# EAGLE design freeDSP (EAGLE 7.6.0)
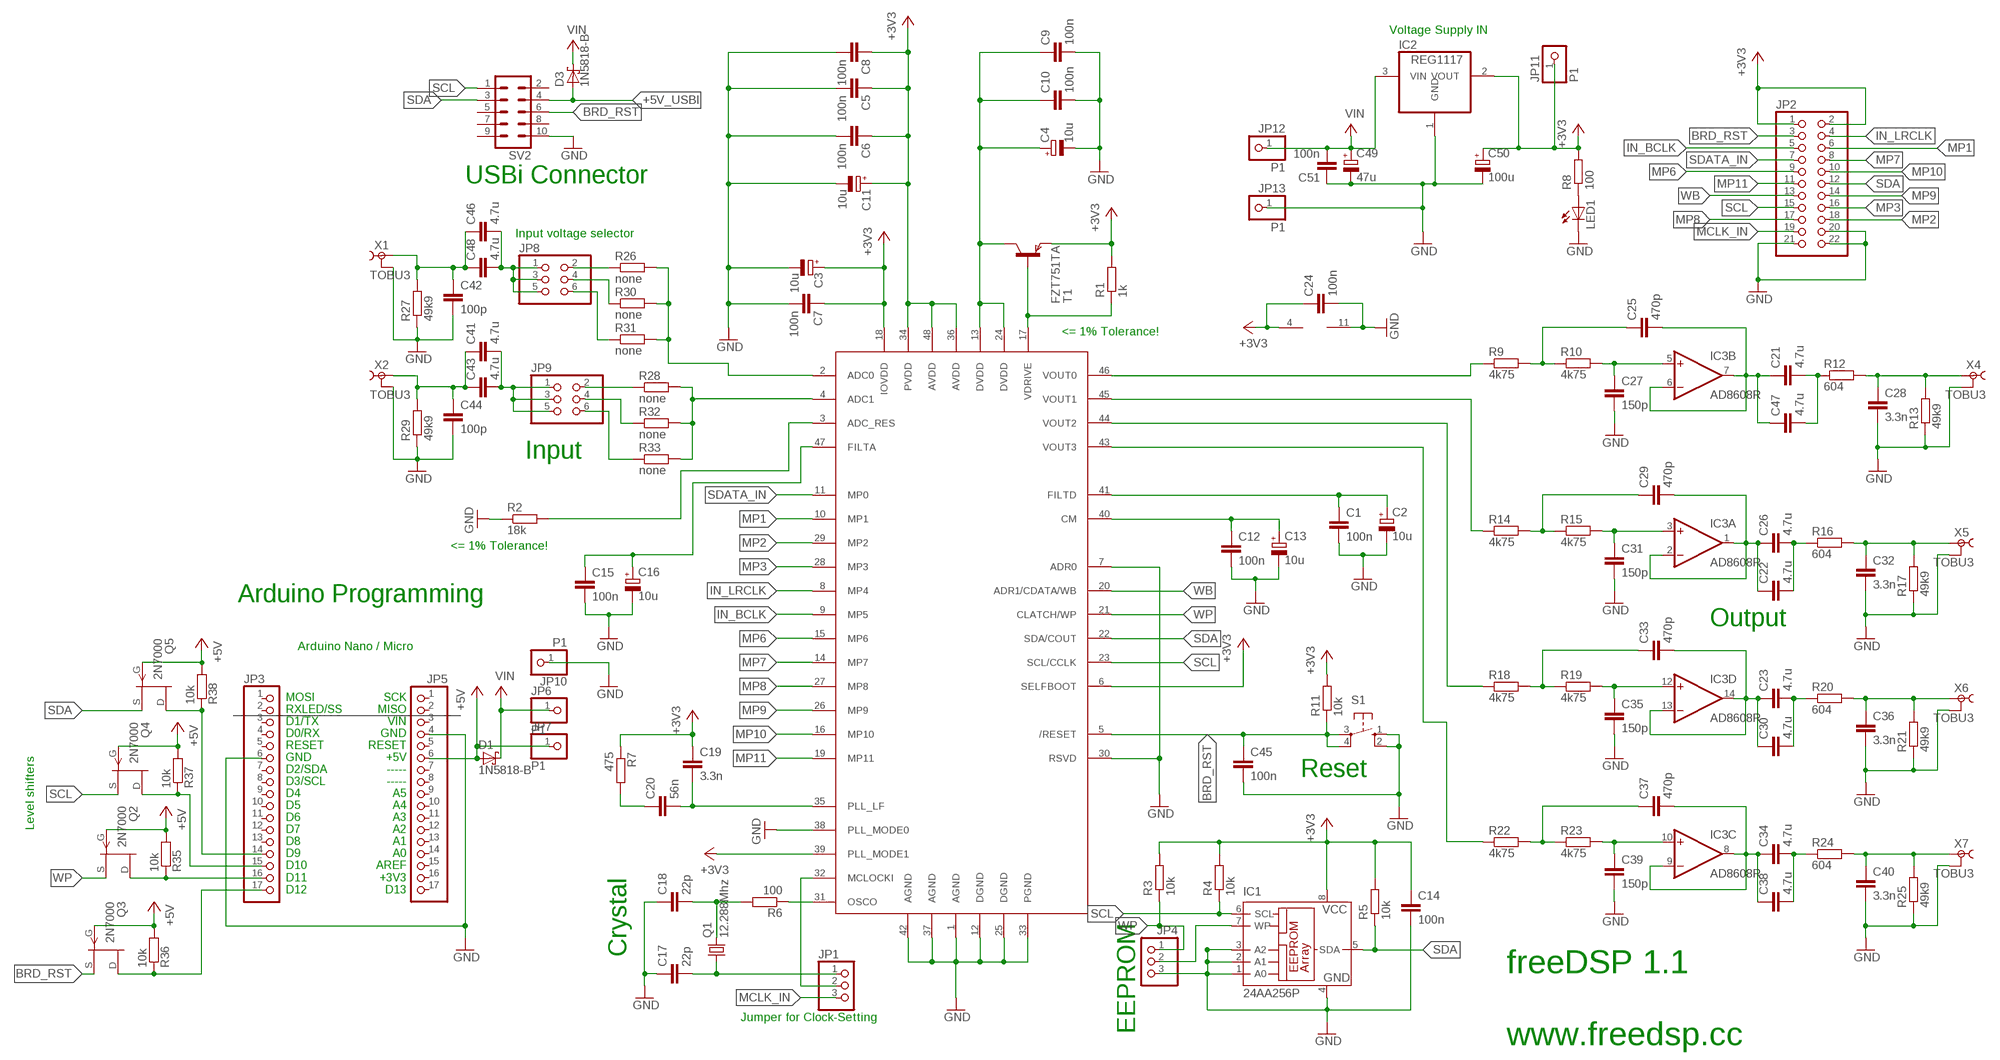
[diagram p0: schematic, sheet 1]

## Parts
C1  100n  C-EU050-025X075  [C050-025X075]
C2  10u  CPOL-EUE1.8-4  [E1,8-4]
C3  10u  CPOL-EUE1.8-4  [E1,8-4]
C4  10u  CPOL-EUE1.8-4  [E1,8-4]
C5  100n  C-EU050-025X075  [C050-025X075]
C6  100n  C-EU050-025X075  [C050-025X075]
C7  100n  C-EU050-025X075  [C050-025X075]
C8  100n  C-EU050-025X075  [C050-025X075]
C9  100n  C-EU050-025X075  [C050-025X075]
C10  100n  C-EU050-025X075  [C050-025X075]
C11  10u  CPOL-EUE1.8-4  [E1,8-4]
C12  100n  C-EU050-025X075  [C050-025X075]
C13  10u  CPOL-EUE1.8-4  [E1,8-4]
C14  100n  C-EU050-025X075  [C050-025X075]
C15  100n  C-EU050-025X075  [C050-025X075]
C16  10u  CPOL-EUE1.8-4  [E1,8-4]
C17  22p  C-EU025-025X050  [C025-025X050]
C18  22p  C-EU025-025X050  [C025-025X050]
C19  3.3n  C-EU050-025X075  [C050-025X075]
C20  56n  C-EU050-025X075  [C050-025X075]
C21  4.7u  C-EU025-025X050  [C025-025X050]
C22  4.7u  C-EU025-025X050  [C025-025X050]
C23  4.7u  C-EU025-025X050  [C025-025X050]
C24  100n  C-EU050-025X075  [C050-025X075]
C25  470p  C-EU050-050X075  [C050-050X075]
C26  4.7u  C-EU025-025X050  [C025-025X050]
C27  150p  C-EU050-050X075  [C050-050X075]
C28  3.3n  C-EU050-025X075  [C050-025X075]
C29  470p  C-EU050-050X075  [C050-050X075]
C30  4.7u  C-EU025-025X050  [C025-025X050]
C31  150p  C-EU050-050X075  [C050-050X075]
C32  3.3n  C-EU050-025X075  [C050-025X075]
C33  470p  C-EU050-050X075  [C050-050X075]
C34  4.7u  C-EU025-025X050  [C025-025X050]
C35  150p  C-EU050-050X075  [C050-050X075]
C36  3.3n  C-EU050-025X075  [C050-025X075]
C37  470p  C-EU050-050X075  [C050-050X075]
C38  4.7u  C-EU025-025X050  [C025-025X050]
C39  150p  C-EU050-050X075  [C050-050X075]
C40  3.3n  C-EU050-025X075  [C050-025X075]
C41  4.7u  C-EU025-025X050  [C025-025X050]
C42  100p  C-EU025-025X050  [C025-025X050]
C43  4.7u  C-EU025-025X050  [C025-025X050]
C44  100p  C-EU025-025X050  [C025-025X050]
C45  100n  C-EU050-025X075  [C050-025X075]
C46  4.7u  C-EU025-025X050  [C025-025X050]
C47  4.7u  C-EU025-025X050  [C025-025X050]
C48  4.7u  C-EU025-025X050  [C025-025X050]
C49  47u  CPOL-EUE2.5-6  [E2,5-6]
C50  100u  CPOL-EUE2.5-6  [E2,5-6]
C51  100n  C-EU050-025X075  [C050-025X075]
D1  1N5818-B  [DO41-7.6]
D3  1N5818-B  [DO41-7.6]
IC1  24AA256P  [DIL8]
IC2  REG1117  [SOT223]
IC3  AD8608R  [SO-14]
JP1  PINHD-1X3  [1X03]
JP2  PINHD-2X11  [2X11]
JP3  PINHD-1X17  [1X17]
JP4  PINHD-1X3  [1X03]
JP5  PINHD-1X17  [1X17]
JP6  P1  PINHD-1X1  [1X01]
JP7  P1  PINHD-1X1  [1X01]
JP8  PINHD-2X3  [2X03]
JP9  PINHD-2X3  [2X03]
JP10  P1  PINHD-1X1  [1X01]
JP11  P1  PINHD-1X1  [1X01]
JP12  P1  PINHD-1X1  [1X01]
JP13  P1  PINHD-1X1  [1X01]
LED1  LED3MM  [LED3MM]
Q1  12.288Mhz  CRYSTALSM49  [SM49]
Q2  2N7000  2N3819  [TO92]
Q3  2N7000  2N3819  [TO92]
Q4  2N7000  2N3819  [TO92]
Q5  2N7000  2N3819  [TO92]
R1  1k  R-EU_0204/7  [0204/7]
R2  18k  R-EU_0204/7  [0204/7]
R3  10k  R-EU_0204/7  [0204/7]
R4  10k  R-EU_0204/7  [0204/7]
R5  10k  R-EU_0204/7  [0204/7]
R6  100  R-EU_0204/7  [0204/7]
R7  475  R-EU_0204/7  [0204/7]
R8  100  R-EU_0204/7  [0204/7]
R9  4k75  R-EU_0204/7  [0204/7]
R10  4k75  R-EU_0204/7  [0204/7]
R11  10k  R-EU_0204/7  [0204/7]
R12  604  R-EU_0204/7  [0204/7]
R13  49k9  R-EU_0204/7  [0204/7]
R14  4k75  R-EU_0204/7  [0204/7]
R15  4k75  R-EU_0204/7  [0204/7]
R16  604  R-EU_0204/7  [0204/7]
R17  49k9  R-EU_0204/7  [0204/7]
R18  4k75  R-EU_0204/7  [0204/7]
R19  4k75  R-EU_0204/7  [0204/7]
R20  604  R-EU_0204/7  [0204/7]
R21  49k9  R-EU_0204/7  [0204/7]
R22  4k75  R-EU_0204/7  [0204/7]
R23  4k75  R-EU_0204/7  [0204/7]
R24  604  R-EU_0204/7  [0204/7]
R25  49k9  R-EU_0204/7  [0204/7]
R26  none  R-EU_0204/7  [0204/7]
R27  49k9  R-EU_0204/7  [0204/7]
R28  none  R-EU_0204/7  [0204/7]
R29  49k9  R-EU_0204/7  [0204/7]
R30  none  R-EU_0204/7  [0204/7]
R31  none  R-EU_0204/7  [0204/7]
R32  none  R-EU_0204/7  [0204/7]
R33  none  R-EU_0204/7  [0204/7]
R35  10k  R-EU_0204/7  [0204/7]
R36  10k  R-EU_0204/7  [0204/7]
R37  10k  R-EU_0204/7  [0204/7]
R38  10k  R-EU_0204/7  [0204/7]
S1  10-XX  [B3F-10XX]
SV2  ML10  [ML10]
T1  FZT751TA  FZT789A  [SOT223]
U$1  ADAU1701  [LQFP-48]
X1  TOBU3  [TOBU3]
X2  TOBU3  [TOBU3]
X4  TOBU3  [TOBU3]
X5  TOBU3  [TOBU3]
X6  TOBU3  [TOBU3]
X7  TOBU3  [TOBU3]

## Nets
1V8: C4.+ C9.1 C10.1 T1.2(C) T1.4(C) U$1.13(DVDD) U$1.24(DVDD)
+3V3: C3.+ C5.1 C6.1 C7.1 C8.1 C11.+ C14.1 C19.1 C24.1 C50.+ IC1.8(VCC) IC2.2(VOUT) IC3.4(V+) JP2.1 JP2.2 JP11.1 R1.2 R3.2 R4.2 R5.2 R7.1 R8.2 R11.2 T1.3(E) U$1.6(SELFBOOT) U$1.18(IOVDD) U$1.34(PVDD) U$1.36(AVDD) U$1.39(PLL_MODE1) U$1.48(AVDD)
+5V: D1.A JP5.6 JP7.1 Q2.2(G) Q3.2(G) Q4.2(G) Q5.2(G) R35.2 R36.2 R37.2 R38.2
+5V_USBI: D3.A SV2.4
ADC0: R28.2 R32.2 R33.2 U$1.4(ADC1)
BRD_RST: C45.1 JP2.3 Q3.3(S) R11.1 S1.3(P) S1.4(P1) SV2.6 U$1.5(/RESET)
CM: C12.1 C13.+ U$1.40(CM)
FILTA: C15.1 C16.+ U$1.47(FILTA)
FILTD: C1.1 C2.+ U$1.41(FILTD)
FILTOUT0: C28.1 R12.2 R13.2 X4.1
FILTOUT1: C32.1 R16.2 R17.2 X5.1
FILTOUT2: C36.1 R20.2 R21.2 X6.1
FILTOUT3: C40.1 R24.2 R25.2 X7.1
GND: C1.2 C2.- C3.- C4.- C5.2 C6.2 C7.2 C8.2 C9.2 C10.2 C11.- C12.2 C13.- C14.2 C15.2 C16.- C17.1 C18.1 C24.2 C27.2 C28.2 C31.2 C32.2 C35.2 C36.2 C39.2 C40.2 C42.2 C44.2 C45.2 C49.- C50.- C51.1 IC1.1(A0) IC1.2(A1) IC1.3(A2) IC1.4(GND) IC2.1(GND) IC3.11(V-) JP2.20 JP2.21 JP2.22 JP3.6 JP4.3 JP5.4 JP10.1 JP13.1 LED1.K(C) R2.1 R13.1 R17.1 R21.1 R25.1 R27.1 R29.1 S1.1(S) S1.2(S1) SV2.10 U$1.1(AGND) U$1.7(ADR0) U$1.12(DGND) U$1.25(DGND) U$1.30(RSVD) U$1.33(PGND) U$1.37(AGND) U$1.38(PLL_MODE0) U$1.42(AGND) X1.2 X1.2@1 X1.2@2 X2.2 X2.2@1 X2.2@2 X4.2 X4.2@1 X4.2@2 X5.2 X5.2@1 X5.2@2 X6.2 X6.2@1 X6.2@2 X7.2 X7.2@1 X7.2@2
IN_BCLK: JP2.5 U$1.9(MP5)
IN_LRCLK: JP2.4 U$1.8(MP4)
MCLK_IN: JP1.3 JP2.19
MP1: JP2.6 U$1.10(MP1)
MP2: JP2.18 U$1.29(MP2)
MP3: JP2.16 U$1.28(MP3)
MP6: JP2.9 U$1.15(MP6)
MP7: JP2.8 U$1.14(MP7)
MP8: JP2.17 U$1.27(MP8)
MP9: JP2.14 U$1.26(MP9)
MP10: JP2.10 U$1.16(MP10)
MP11: JP2.11 U$1.19(MP11)
N$1: R2.2 U$1.3(ADC_RES)
N$2: R1.1 T1.1(B) U$1.17(VDRIVE)
N$3: C19.2 C20.2 U$1.35(PLL_LF)
N$4: C23.1 C30.1 C33.2 IC3.13(D:-IN) IC3.14(D:OUT)
N$5: C20.1 R7.2
N$6: C18.2 Q1.2 R6.2
N$7: C17.2 JP1.1 Q1.1
N$8: R6.1 U$1.31(OSCO)
N$9: LED1.A R8.1
N$10: JP1.2 U$1.32(MCLOCKI)
N$11: JP3.15 Q4.1(D) R37.1
N$12: C21.2 C47.2 R12.1
N$13: C29.1 R14.2 R15.1
N$14: JP3.14 Q5.1(D) R38.1
N$15: C22.1 C26.1 C29.2 IC3.1(A:OUT) IC3.2(A:-IN)
N$16: C31.1 IC3.3(A:+IN) R15.2
N$17: C25.1 R9.2 R10.1
N$18: C21.1 C25.2 C47.1 IC3.6(B:-IN) IC3.7(B:OUT)
N$19: C22.2 C26.2 R16.1
N$20: C27.1 IC3.5(B:+IN) R10.2
N$21: C33.1 R18.2 R19.1
N$22: C23.2 C30.2 R20.1
N$23: JP3.16 Q2.1(D) R35.1
N$24: C35.1 IC3.12(D:+IN) R19.2
N$25: JP3.17 Q3.1(D) R36.1
N$26: C37.1 R22.2 R23.1
N$27: C34.1 C37.2 C38.1 IC3.8(C:OUT) IC3.9(C:-IN)
N$28: C39.1 IC3.10(C:+IN) R23.2
N$29: C34.2 C38.2 R24.1
N$30: C46.2 C48.2 JP8.1 JP8.3 JP8.5
N$31: C42.1 C46.1 C48.1 R27.2 X1.1
N$32: JP8.2 R26.1
N$33: JP8.4 R30.1
N$34: C41.1 C43.1 C44.1 R29.2 X2.1
N$35: JP8.6 R31.1
N$36: C41.2 C43.2 JP9.1 JP9.3 JP9.5
N$37: JP9.2 R28.1
N$38: JP9.4 R32.1
N$39: JP9.6 R33.1
N$40: R26.2 R30.2 R31.2 U$1.2(ADC0)
N$43: IC1.7(WP) JP4.2
SCL: IC1.6(SCL) JP2.15 Q4.3(S) R4.1 SV2.1 U$1.23(SCL/CCLK)
SDA: IC1.5(SDA) JP2.12 Q5.3(S) R5.1 SV2.3 U$1.22(SDA/COUT)
SDATA_IN: JP2.7 U$1.11(MP0)
V+: C49.+ C51.2 D1.C D3.C IC2.3(VIN) JP6.1 JP12.1 ; supply symbol labelled VIN
VOUT0: R9.1 U$1.46(VOUT0)
VOUT1: R14.1 U$1.45(VOUT1)
VOUT2: R18.1 U$1.44(VOUT2)
VOUT3: R22.1 U$1.43(VOUT3)
WB: JP2.13 U$1.20(ADR1/CDATA/WB)
WP: JP4.1 Q2.3(S) R3.1 U$1.21(CLATCH/WP)
Unconnected: JP3.1 JP3.2 JP3.3 JP3.4 JP3.5 JP3.7 JP3.8 JP3.9 JP3.10 JP3.11 JP3.12 JP3.13 JP5.1 JP5.2 JP5.3 JP5.5 JP5.7 JP5.8 JP5.9 JP5.10 JP5.11 JP5.12 JP5.13 JP5.14 JP5.15 JP5.16 JP5.17 SV2.2 SV2.5 SV2.7 SV2.8 SV2.9

## Notes on the sheet
- Voltage Supply IN
- USBi Connector
- Input voltage selector
- <= 1% Tolerance!
- Input
- <= 1% Tolerance!
- Arduino Programming
- Output
- Arduino Nano / Micro
- Reset
- Level shifters
- Crystal
- MOSI
  RXLED/SS
  D1/TX
  D0/RX
  RESET
  GND
  D2/SDA
  D3/SCL
  D4
  D5
  D6
  D7
  D8
  D9
  D10
  D11
  D12
- SCK
  MISO
  VIN
  GND
  RESET
  +5V
  -----
  -----
  A5
  A4
  A3
  A2
  A1
  A0
  AREF
  +3V3
  D13
- Jumper for Clock-Setting
- EEPROM
- freeDSP 1.1
  
  www.freedsp.cc

## Library data of the parts
C1 C5-C10 C12 C14 C15 C19-C24 C26-C28 C30-C32 C34-C36 C38-C41 C43 C45-C48 C51 = resistor:C-EU: CAPACITOR, European symbol
C2-C4 C11 C13 C16 C49 C50 = rcl:CPOL-EU: POLARIZED CAPACITOR, European symbol
C17 C18 C25 C29 C33 C37 C42 C44 = rcl:C-EU: CAPACITOR, European symbol
D1 D3 = diode:1N581*: 1.0A SCHOTTKY BARRIER RECTIFIER Source: http://www.diodes.com/datasheets/ds23001.pdf
IC1 = microchip:24*: Serial EEPROM I2C; MF: MICROCHIP; MPN: 24AA256-I/P; OC_FARNELL: 1331294; OC_NEWARK: 92C6872
IC2 = burr-brown:REG1117: 800mA and 1A Low Dropout (LDO) Positive Regulator 1.8V, 2.5V, 2.85V, 3.3V, 5V, and Adj; MPN: REG1117; OC_FARNELL: 1097566; OC_NEWARK: 14P6981
IC3 = 0-ADI-variety:AD8608*
JP1 JP4 = pinhead:PINHD-1X3: PIN HEADER
JP2 = pinhead:PINHD-2X11: PIN HEADER
JP3 JP5 = pinhead:PINHD-1X17: PIN HEADER
JP6 JP7 JP10-JP13 = adafruit:PINHD-1X1: Pin header 1x1 for 0.1" spacing With round pins
JP8 JP9 = pinhead:PINHD-2X3: PIN HEADER
LED1 = led:LED: LED OSRAM: - CHIPLED LG R971, LG N971, LY N971, LG Q971, LY Q971, LO R971, LY R971 LH N974, LH R974 LS Q976, LO Q976, LY Q976 LO Q996 - Hyper CHIPLED LW Q18S LB Q993, LB Q99A, LB R99A - SideLED LS A670, LO A670, LY A670, LG A670, LP A670 LB A673, LV A673, LT A673, LW A673 LH A674 LY A675 LS A676, LA A676, LO A676, LY A676, LW A676 LS A679, LY A679, LG A679 - Hyper Micro SIDELED® LS Y876, LA Y876, LO Y876, LY Y876 LT Y87S - SmartLED LW L88C, LW L88S LB L89C, LB L89S, LG L890 LS L89K, LO L89K, LY L89K LS L896, LA L896, LO L896, LY L896 - TOPLED LS T670, LO T670, LY T670, LG T670, LP T670 LSG T670, LSP T670, LSY T670, LOP T670, LYG T670 LG T671, LOG T671, LSG T671 LB T673, LV T673, LT T673, LW T673 LH T674 LS T676, LA T676, LO T676, LY T676, LB T676, LH T676, LSB T676, LW T676 LB T67C, LV T67C, LT T67C, LS T67K, LO T67K, LY T67K, LW E67C LS E67B, LA E67B, LO E67B, LY E67B, LB E67C, LV E67C, LT E67C LW T67C LS T679, LY T679, LG T679 LS T770, LO T770, LY T770, LG T770, LP T770 LB T773, LV T773, LT T773, LW T773 LH T774 LS E675, LA E675, LY E675, LS T675 LS T776, LA T776, LO T776, LY T776, LB T776 LHGB T686 LT T68C, LB T68C - Hyper Mini TOPLED® LB M676 - Mini TOPLED Santana® LG M470 LS M47K, LO M47K, LY M47K Source: http://www.osram.convergy.de LUXEON: - LUMILED® LXK2-PW12-R00, LXK2-PW12-S00, LXK2-PW14-U00, LXK2-PW14-V00 LXK2-PM12-R00, LXK2-PM12-S00, LXK2-PM14-U00 LXK2-PE12-Q00, LXK2-PE12-R00, LXK2-PE12-S00, LXK2-PE14-T00, LXK2-PE14-U00 LXK2-PB12-K00, LXK2-PB12-L00, LXK2-PB12-M00, LXK2-PB14-N00, LXK2-PB14-P00, LXK2-PB14-Q00 LXK2-PR12-L00, LXK2-PR12-M00, LXK2-PR14-Q00, LXK2-PR14-R00 LXK2-PD12-Q00, LXK2-PD12-R00, LXK2-PD12-S00 LXK2-PH12-R00, LXK2-PH12-S00 LXK2-PL12-P00, LXK2-PL12-Q00, LXK2-PL12-R00 Source: www.luxeon.com KINGBRIGHT: KA-3528ASYC Source: www.kingbright.com
Q1 = crystal:CRYSTAL: CRYSTAL; OC_FARNELL: unknown; OC_NEWARK: unknown
Q2-Q5 = transistor-fet:2N3819: N-Channel Junction FET
R1-R33 R35-R38 = resistor:R-EU_: RESISTOR, European symbol
S1 = switch-omron:10-XX: OMRON SWITCH; MPN: B3F-1000; OC_FARNELL: 176432; OC_NEWARK: 36M3542
SV2 = con-harting-ml:ML10: HARTING; OC_FARNELL: unknown; OC_NEWARK: unknown
T1 = zetex:FZT789A: PNP TRANSISTOR; MPN: FZT789A; OC_FARNELL: 9526633; OC_NEWARK: 97K0407
U$1 = analog-devices_2:ADAU1701
X1 X2 X4-X7 = con-hirschmann_verbessert:TOBU3: Female Cinch CONNECTOR ( RCA Jack ); MF: FARNELL; MPN: TOBU 3; OC_FARNELL: 592791; OC_NEWARK: 06WX5914

## Net classes
0 default: width 0.152 mm

## Board
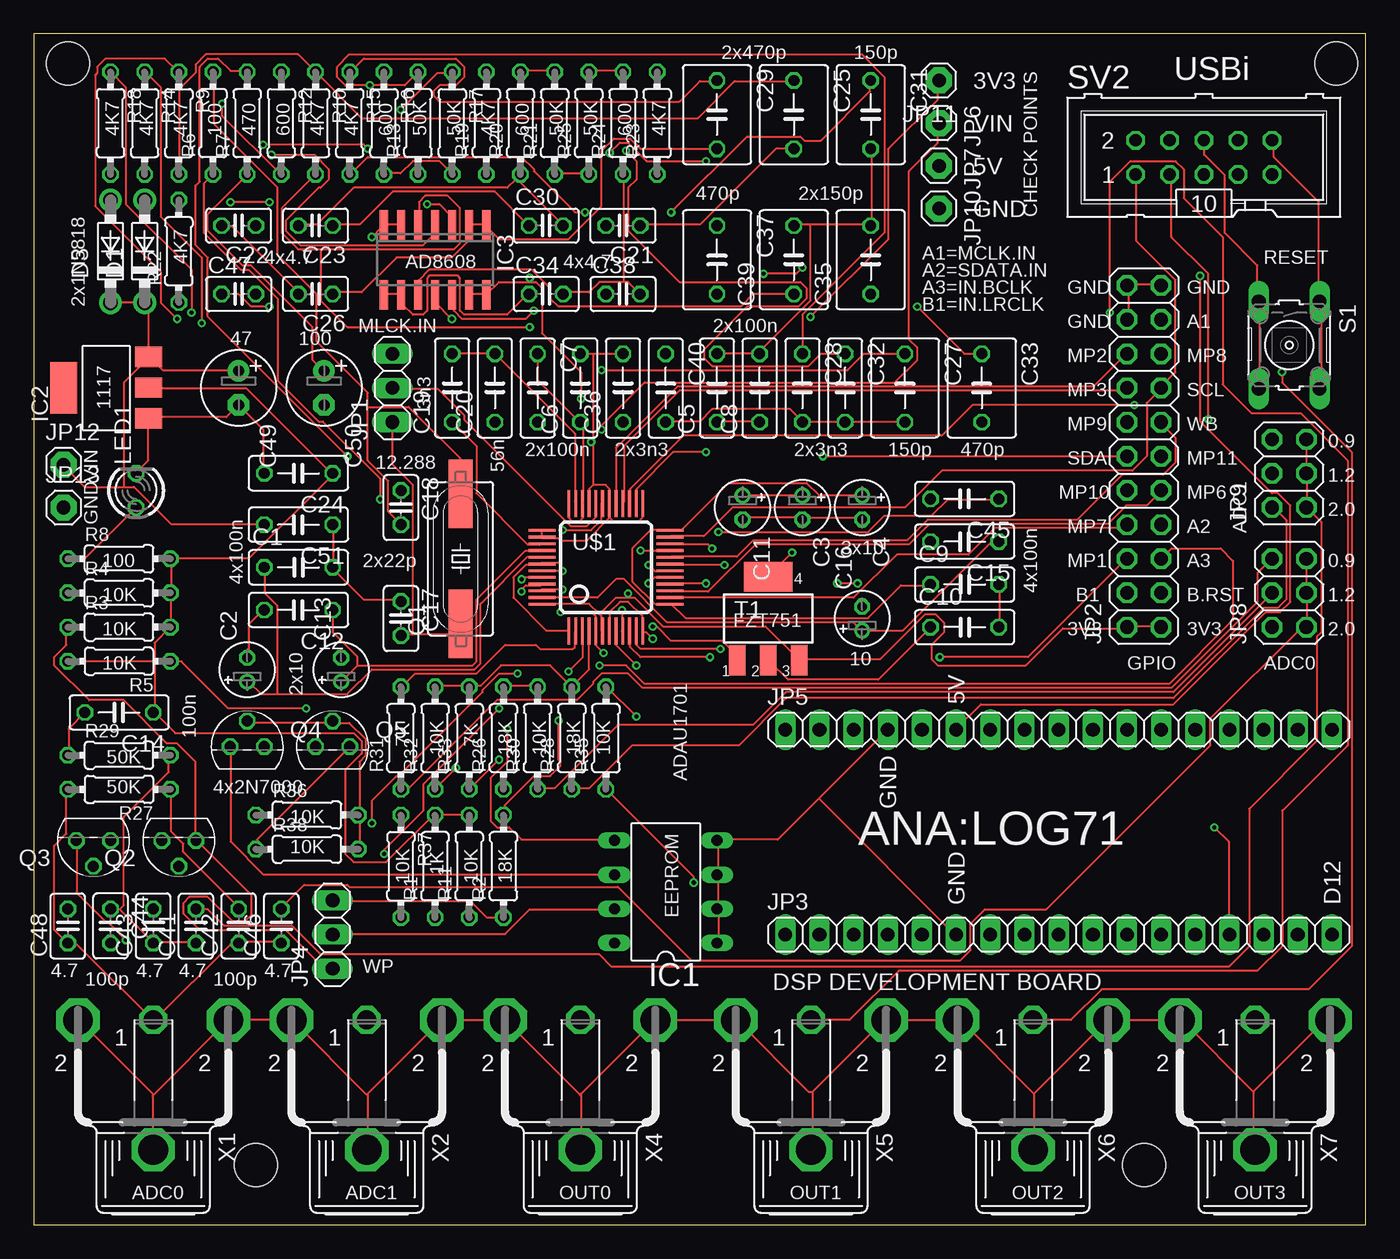
[diagram p1: board, top side]
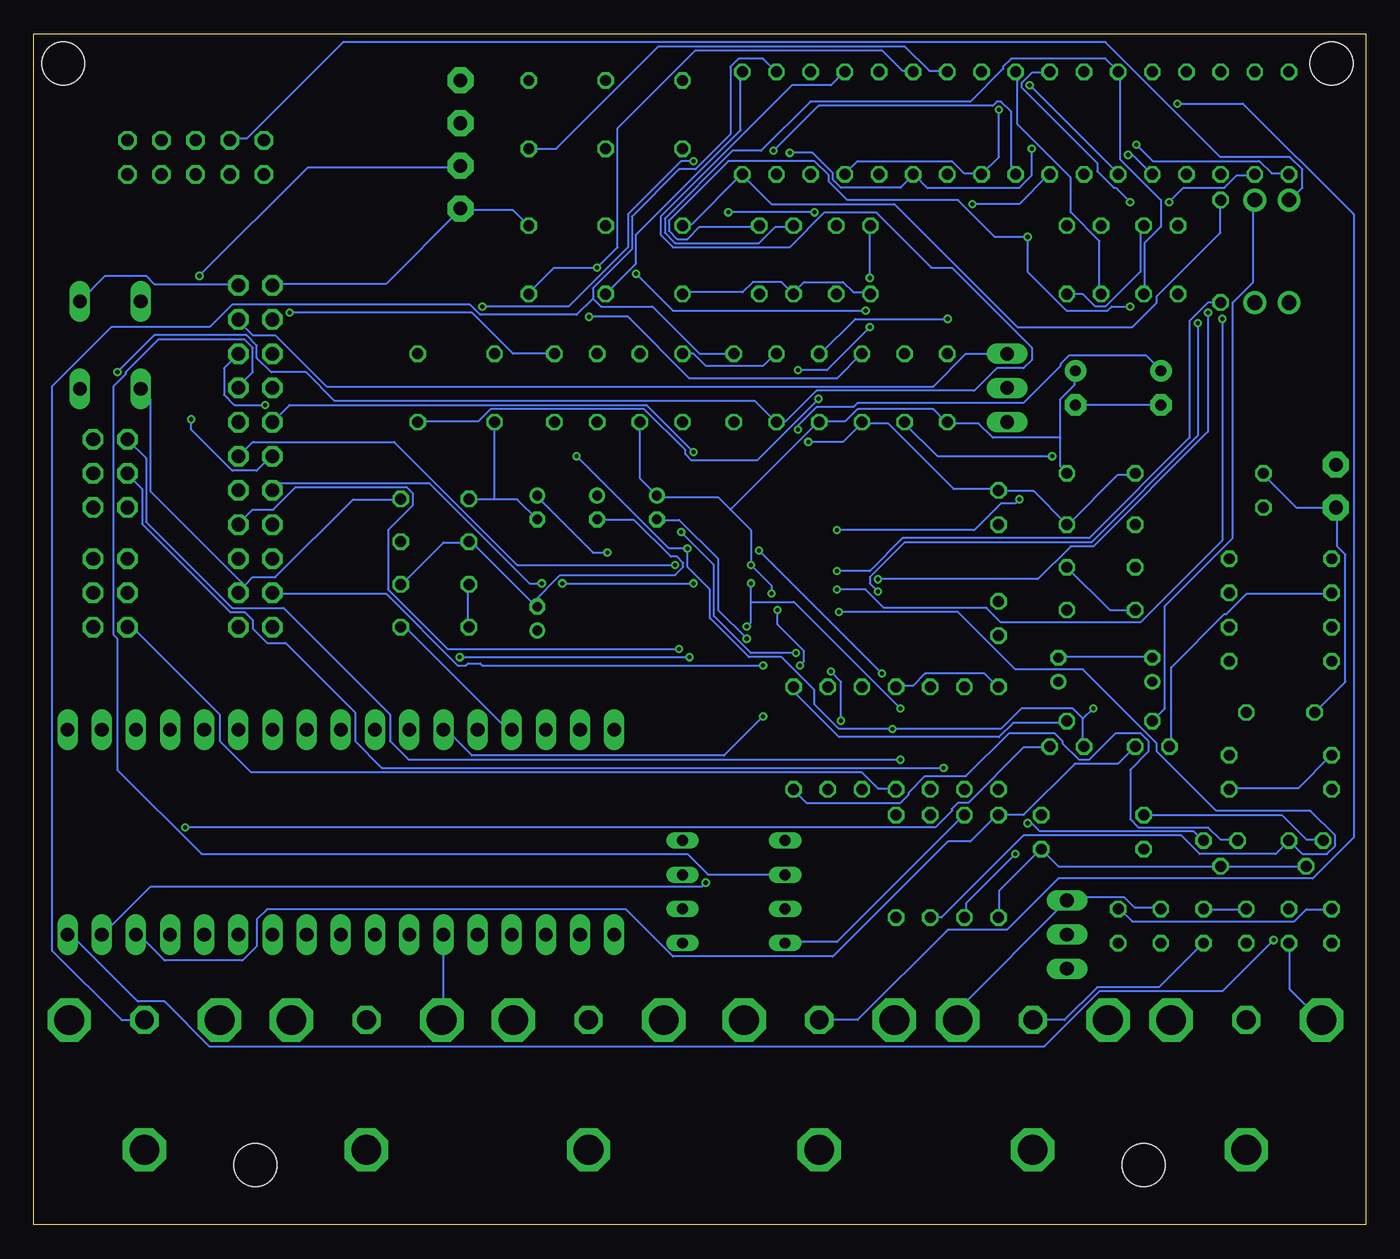
[diagram p2: board, bottom side, seen from below]

Size 99.04 x 88.57 mm. Coordinates in mm from the lower left corner, seen from the top.
Outline: 0,0 99.04,0 99.04,88.57 0,88.57 0,0
Copper layers (1*16): Top 0.035mm / dielectric 1.6mm / Bottom 0.035mm
Design rules "Elecrow_2-layer_PCB_eagle_rule": minimum track width 6mil, minimum drill 12mil, track to track 6mil, track to pad 8mil, pad to pad 12mil, via to via 12mil, smd to smd 0mil, copper to edge 20mil, drill to drill 10mil, minimum pad ring 6mil, minimum via ring 6mil, stop-mask expansion 0mil, vias tented up to drill 100mil, thermal gap 10mil
Holes 3.2 mm at 2.54,86.36 96.84,86.36 16.51,4.45 82.55,4.45

### Footprints (pad centres in the part's own frame; a part is rotated, then mirrored left to right if it is on the bottom)
C050-025X075 = drill 0.813 octagon: 1 -2.54,0; 2 2.54,0
E1,8-4 = drill 0.711 pad 1.168: + -0.889,0 | drill 0.711 pad 1.168 octagon: - 0.889,0
C025-025X050 = drill 0.813 octagon: 1 -1.27,0; 2 1.27,0
C050-050X075 = drill 0.813 octagon: 1 -2.54,0; 2 2.54,0
E2,5-6 = drill 0.813 pad 1.6: + -1.27,0 | drill 0.813 pad 1.6 octagon: - 1.27,0
DO41-7.6 = drill 1.1 pad 1.7: A 3.81,0; C -3.81,0
DIL8 = drill 0.813 long: 1 -3.81,-3.81; 2 -1.27,-3.81; 3 1.27,-3.81; 4 3.81,-3.81; 5 3.81,3.81; 6 1.27,3.81; 7 -1.27,3.81; 8 -3.81,3.81
SOT223 = smd 1.499 x 2.007: 1 -2.261,-3.15; 2 0.025,-3.15; 3 2.311,-3.15 | smd 3.81 x 2.007: 4 0,3.15
SO-14 = smd 0.6 x 2.2: 1 -3.81,-2.6; 2 -2.54,-2.6; 3 -1.27,-2.6; 4 0,-2.6; 5 1.27,-2.6; 6 2.54,-2.6; 7 3.81,-2.6; 8 3.81,2.6; 9 2.54,2.6; 10 1.27,2.6; 11 0,2.6; 12 -1.27,2.6; 13 -2.54,2.6; 14 -3.81,2.6
1X03 = drill 1.016 long: 1 -2.54,0; 2 0,0; 3 2.54,0
2X11 = drill 1.016 octagon: 1 -12.7,-1.27; 2 -12.7,1.27; 3 -10.16,-1.27; 4 -10.16,1.27; 5 -7.62,-1.27; 6 -7.62,1.27; 7 -5.08,-1.27; 8 -5.08,1.27; 9 -2.54,-1.27; 10 -2.54,1.27; 11 0,-1.27; 12 0,1.27; 13 2.54,-1.27; 14 2.54,1.27; 15 5.08,-1.27; 16 5.08,1.27; 17 7.62,-1.27; 18 7.62,1.27; 19 10.16,-1.27; 20 10.16,1.27; 21 12.7,-1.27; 22 12.7,1.27
1X17 = drill 1.016 long: 1 -20.32,0; 2 -17.78,0; 3 -15.24,0; 4 -12.7,0; 5 -10.16,0; 6 -7.62,0; 7 -5.08,0; 8 -2.54,0; 9 0,0; 10 2.54,0; 11 5.08,0; 12 7.62,0; 13 10.16,0; 14 12.7,0; 15 15.24,0; 16 17.78,0; 17 20.32,0
1X01 = drill 1.016 pad 1.93 octagon: 1 0,0
2X03 = drill 1.016 octagon: 1 -2.54,-1.27; 2 -2.54,1.27; 3 0,-1.27; 4 0,1.27; 5 2.54,-1.27; 6 2.54,1.27
LED3MM = drill 0.813 octagon: A -1.27,0; K 1.27,0
SM49 = smd 5.08 x 1.778: 1 -4.826,0; 2 4.826,0
TO92 = drill 0.813 octagon: 1 1.27,0; 2 0,1.905; 3 -1.27,0
0204/7 = drill 0.813 octagon: 1 -3.81,0; 2 3.81,0
B3F-10XX = drill 1.016 long: 1 -3.251,2.261; 2 3.251,2.261; 3 -3.251,-2.261; 4 3.251,-2.261
ML10 = drill 0.914 octagon: 1 -5.08,-1.27; 2 -5.08,1.27; 3 -2.54,-1.27; 4 -2.54,1.27; 5 0,-1.27; 6 0,1.27; 7 2.54,-1.27; 8 2.54,1.27; 9 5.08,-1.27; 10 5.08,1.27
SOT223' = smd 1.219 x 2.235: 1 -2.311,-3.099; 2 0,-3.099; 3 2.311,-3.099 | smd 3.6 x 2.2: 4 0,3.099
LQFP-48 = smd 0.2 x 2: 1 -2.75,-4.75; 2 -2.25,-4.75; 3 -1.75,-4.75; 4 -1.25,-4.75; 5 -0.75,-4.75; 6 -0.25,-4.75; 7 0.25,-4.75; 8 0.75,-4.75; 9 1.25,-4.75; 10 1.75,-4.75; 11 2.25,-4.75; 12 2.75,-4.75; 25 2.75,4.75; 26 2.25,4.75; 27 1.75,4.75; 28 1.25,4.75; 29 0.75,4.75; 30 0.25,4.75; 31 -0.25,4.75; 32 -0.75,4.75; 33 -1.25,4.75; 34 -1.75,4.75; 35 -2.25,4.75; 36 -2.75,4.75 | smd 2 x 0.2: 13 4.75,-2.75; 14 4.75,-2.25; 15 4.75,-1.75; 16 4.75,-1.25; 17 4.75,-0.75; 18 4.75,-0.25; 19 4.75,0.25; 20 4.75,0.75; 21 4.75,1.25; 22 4.75,1.75; 23 4.75,2.25; 24 4.75,2.75; 37 -4.75,2.75; 38 -4.75,2.25; 39 -4.75,1.75; 40 -4.75,1.25; 41 -4.75,0.75; 42 -4.75,0.25; 43 -4.75,-0.25; 44 -4.75,-0.75; 45 -4.75,-1.25; 46 -4.75,-1.75; 47 -4.75,-2.25; 48 -4.75,-2.75
TOBU3 = drill 1.397 octagon: 1 0,-2.54 | drill 2.21 octagon: 2 5.588,-2.54; 2@1 -5.588,-2.54; 2@2 0,7.11

### Placement (x,y rotation side)
C1  19.68,48.9 0 top
C2  15.88,41.27 90 top
C3  57.15,53.34 270 top
C4  61.59,53.34 270 top
C5  50.8,62.23 90 top
C6  40.64,62.23 90 top
C7  37.47,62.23 270 top
C8  53.98,62.23 90 top
C9  69.22,47.62 0 top
C10  69.22,44.45 0 top
C11  52.7,53.34 270 top
C12  19.68,45.72 180 top
C13  22.86,41.27 90 top
C14  6.35,38.1 180 top
C15  69.22,50.8 180 top
C16  61.59,45.09 90 top
C17  27.3,45.09 270 top
C18  27.3,53.34 270 top
C19  31.11,62.23 90 top
C20  34.29,62.23 90 top
C21  43.81,74.3 180 top
C22  15.24,74.3 180 top
C23  20.95,74.3 180 top
C24  19.68,55.88 180 top
C25  56.52,82.55 270 top
C26  20.95,69.22 180 top
C27  64.77,62.23 270 top
C28  57.15,62.23 270 top
C29  50.8,82.55 270 top
C30  38.1,74.3 0 top
C31  62.23,82.55 270 top
C32  60.33,62.23 270 top
C33  70.48,62.23 270 top
C34  38.1,69.22 0 top
C35  62.23,71.75 90 top
C36  43.81,62.23 90 top
C37  50.8,71.75 270 top
C38  43.81,69.22 0 top
C39  56.52,71.75 90 top
C40  46.99,62.23 270 top
C41  12.06,22.23 90 top
C42  15.24,22.23 90 top
C43  8.89,22.23 90 top
C44  5.71,22.23 270 top
C45  69.22,53.98 180 top
C46  18.41,22.23 90 top
C47  15.24,69.22 0 top
C48  2.54,22.23 90 top
C49  15.24,62.23 270 top
C50  21.59,62.23 270 top
C51  19.68,52.07 180 top
D1  8.26,72.39 90 top
D3  5.71,72.39 90 top
IC1  46.99,24.77 90 top
IC2  5.4,62.23 90 top
IC3  29.84,71.75 180 top
JP1  26.67,62.23 90 top
JP2  82.55,57.15 90 top
JP3  76.2,21.59 0 top
JP4  22.23,21.59 90 top
JP5  76.2,36.83 0 top
JP6  67.31,81.92 270 top
JP7  67.31,78.74 270 top
JP8  93.34,46.99 90 top
JP9  93.34,55.88 90 top
JP10  67.31,75.56 270 top
JP11  67.31,85.09 180 top
JP12  2.22,56.52 0 top
JP13  2.22,53.34 0 top
LED1  7.62,54.61 90 top
Q1  31.75,49.53 90 top
Q2  10.79,28.57 180 top
Q3  4.45,28.57 180 top
Q4  15.88,35.56 0 top
Q5  22.23,35.56 0 top
R1  29.84,26.67 90 top
R2  34.92,26.67 90 top
R3  6.35,44.45 0 top
R4  6.35,46.99 0 top
R5  6.35,41.91 180 top
R6  13.34,81.92 90 top
R7  15.88,81.92 90 top
R8  6.35,49.53 0 top
R9  10.79,81.92 270 top
R10  20.95,81.92 270 top
R11  32.38,26.67 90 top
R12  18.41,81.92 270 top
R13  28.57,81.92 90 top
R14  8.26,81.92 270 top
R15  23.5,81.92 270 top
R16  26.04,81.92 270 top
R17  31.11,81.92 270 top
R18  5.71,81.92 270 top
R19  33.66,81.92 90 top
R20  36.2,81.92 90 top
R21  38.73,81.92 90 top
R22  10.79,72.39 90 top
R23  46.35,81.92 90 top
R24  43.81,81.92 90 top
R25  41.27,81.92 90 top
R26  34.92,36.2 90 top
R27  6.35,32.38 180 top
R28  40.01,36.2 90 top
R29  6.35,34.92 0 top
R30  37.47,36.2 90 top
R31  27.3,36.2 90 top
R32  29.84,36.2 90 top
R33  32.38,36.2 90 top
R35  42.55,36.2 90 top
R36  20.32,30.48 0 top
R37  27.3,26.67 270 top
R38  20.32,27.94 0 top
S1  93.34,65.41 270 top
SV2  87,79.38 0 top
T1  FZT751TA  [SOT223']  54.61,45.09 0 top
U$1  42.55,48.9 0 top
X1  8.89,12.7 180 top
X2  24.77,12.7 180 top
X4  40.64,12.7 180 top
X5  57.78,12.7 180 top
X6  74.3,12.7 180 top
X7  90.81,12.7 180 top

### Tracks (layer width: path | path; a pad name or v marks a point on that pad's centre or on a via)
1V8  (via drill 0.3)
  Top 0.152: T1.2 54.71,41.91 56.08,40.54 62.79,40.54 66.6,44.35 C10.1 | C4.+ 61.57,54.25 58.37,54.25 57.45,55.17 51.66,55.17 48.16,51.66 47.4,51.66 U$1.24 47.24,51.66 45.87,51.66 44.5,50.29 44.5,47.85 46.18,46.18 47.24,46.18 U$1.13 47.4,46.18 48.46,45.11 62.03,45.11 64.47,47.55 66.6,47.55 C9.1 | v56.39,49.99 54.71,48.31 T1.4
  Bottom 0.152: C9.1 66.75,47.55 66.75,44.5 C10.1 | v56.39,49.99 57.45,49.99 61.57,54.1 C4.+
+3V3  (via drill 0.3)
  Top 0.152: JP2.1 83.82,44.5 81.38,44.5 JP2.2 81.23,44.35 76.5,44.35 73.76,41.6 67.21,41.6 66.75,42.06 66.75,43.13 67.67,44.04 67.67,44.81 67.06,45.41 66.29,45.41 62.94,42.06 57,42.06 T1.3 54.41,44.5 46.79,44.5 44.65,46.63 44.2,46.63 | 42.06,45.41 42.22,45.26 42.22,44.2 U$1.6 | 42.06,45.41 41.3,46.18 37.8,46.18 U$1.48 | 44.2,46.63 43.28,46.63 42.06,45.41 | C5.1 50.9,59.74 53.95,59.74 C8.1 | v45.72,49.07 46.18,48.62 47.24,48.62 U$1.18 | C3.+ 57.15,54.25 52.73,54.25 C11.+ | U$1.36 39.78,53.65 39.78,52.58 40.08,52.27 40.54,52.27 40.84,52.58 40.84,53.65 U$1.34 40.84,53.8 40.84,59.44 40.69,59.59 C6.1 40.54,59.74 37.49,62.79 37.49,64.77 C7.1 | v57.76,67.51 63.55,73.3 63.55,80.01 67.21,83.67 67.21,85.04 JP11.1 | v44.2,46.94 44.2,46.63 | R11.2 R1.2 29.72,30.48 26.21,26.98 23.77,26.98 23.16,27.58 23.16,33.83 24.38,35.05 24.38,35.97 23.77,36.58 10.52,36.58 8.99,38.1 | 10.21,49.53 10.21,47.09 R4.2 10.21,46.94 10.21,44.5 R3.2 8.99,43.28 8.99,41.91 | 8.99,41.91 8.99,38.1 | 8.99,41.91 R5.2 | v17.68,79.55 20.88,79.55 21.95,78.49 21.95,77.72 21.34,77.11 21.18,77.11 18.75,74.68 18.75,73.91 19.81,72.85 28.96,72.85 29.72,73.61 29.72,74.22 IC3.4 | U$1.39 37.64,50.6 36.73,50.6 32.92,54.41 32.92,57.91 31.24,59.59 C19.1 | IC2.2 8.69,62.18 15.85,62.18 22.1,55.93 C24.1 22.25,55.78 16,49.53 10.21,49.53 | R7.1 15.85,78.03 12.95,75.13 12.95,73.91 15.54,71.32 16.15,71.32 20.73,66.75 20.73,64.31 21.49,63.55 C50.+ | 10.21,49.53 R8.2 | 8.99,38.1 C14.1
  Bottom 0.152: 47.24,53.19 48.16,54.1 52.58,54.1 C11.+ 53.95,55.47 53.95,59.59 C8.1 | 47.24,53.19 45.72,51.66 v45.72,49.07 44.2,47.55 v44.2,46.94 | v57.76,67.51 54.86,67.51 50.29,62.94 39.32,62.94 37.49,64.77 C7.1 | 47.24,53.19 40.69,59.74 C6.1 40.54,59.74 38.71,59.74 37.8,60.66 32.16,60.66 31.24,59.74 C19.1 31.09,59.59 28.8,59.59 27.74,58.52 22.71,58.52 | IC1.8 43.13,21.03 39.32,21.03 29.87,30.48 R1.2 | v17.68,79.55 17.37,79.55 16,78.18 R7.1 | 22.71,58.52 22.71,56.39 22.25,55.93 C24.1 | 22.71,58.52 22.71,61.42 21.64,62.48 21.64,63.4 C50.+
+5V  (via drill 0.3)
  Top 0.152: 24.23,30.48 24.23,28.04 R38.2 | Q4.2 16,37.34 22.1,37.34 Q5.2 22.25,37.34 23.47,37.34 24.69,36.12 24.69,34.9 24.23,34.44 24.23,30.48 | v44.81,37.8 42.67,39.93 R35.2 | v86.72,70.56 86.72,59.74 92.05,54.41 92.51,54.41 93.42,53.49 93.42,46.33 92.66,45.57 91.59,45.57 84.73,38.71 70.41,38.71 68.58,36.88 JP5.6 | 24.23,30.48 R36.2
  Bottom 0.152: Q3.2 Q2.2 22.86,26.67 R38.2 24.23,27.89 27.28,24.84 27.28,22.86 R37.2 | R35.2 42.52,39.93 42.52,39.62 39.17,36.27 27.28,36.27 26.21,37.34 22.25,37.34 Q5.2 | v44.81,37.8 47.7,34.9 66.45,34.9 68.28,36.73 68.58,36.73 JP5.6 | Q4.2 14.94,38.41 14.94,46.02 9.91,51.05 9.91,68.58 8.38,70.1 8.38,76.2 D1.A | v86.72,70.56 78.64,78.64 67.36,78.64 JP7.1
+5V_USBI
  Bottom 0.152: SV2.4 84.43,80.77 83.21,80.77 76.05,87.94 19.36,87.94 10.82,79.4 5.64,79.4 4.72,78.49 4.72,77.11 5.64,76.2 D3.A
ADC0
  Top 0.152: R32.2 29.87,40.08 32.31,40.08 R33.2 32.46,40.08 33.22,40.08 34.75,41.6 38.41,41.6 R28.2 41.3,41.3 41.3,44.04 U$1.4
BRD_RST  (via drill 0.3)
  Top 0.152: SV2.6 87.02,80.62 87.02,79.55 88.54,78.03 88.54,73.76 90.98,71.32 90.98,68.73 S1.3 91.14,68.58 91.14,62.18 S1.4 | v39.17,45.57 41.45,45.57 41.76,45.26 41.76,44.2 U$1.5 41.76,44.04 41.76,43.13 v42.37,42.52 | v50.9,51.51 62.03,51.51 63.25,52.73 66.75,52.73 67.97,53.95 71.63,53.95 C45.1
  Bottom 0.152: 83.36,47.55 83.82,47.09 JP2.3 83.36,47.55 | 83.36,47.55 82.75,48.16 81.08,48.16 75.29,53.95 71.78,53.95 C45.1 | 83.36,47.55 90.37,54.56 90.37,61.42 90.98,62.03 S1.4 | v39.17,45.57 30.33,45.57 26.06,41.3 21.03,41.3 15.54,35.81 15.54,35.2 11.12,30.79 4.12,30.79 2.29,28.96 2.29,28.19 2.9,27.58 4.72,27.58 Q3.3 6.71,27.58 12.34,27.58 13.72,28.96 25.45,28.96 31.55,22.86 R11.1 | v50.9,51.51 48.46,49.07 48.46,45.26 45.72,42.52 v42.37,42.52
CM
  Top 0.152: 24.08,41.6 32.61,41.6 32.92,41.91 32.92,46.48 36.58,50.14 37.64,50.14 U$1.40 | C13.+ 24.08,41.6 | 24.08,41.6 24.08,42.22 22.25,44.04 22.25,45.72 C12.1
FILTA
  Top 0.152: U$1.47 37.8,46.63 41.91,46.63 43.28,48.01 43.89,48.01 47.09,44.81 60.96,44.81 61.57,44.2 C16.+ 64.62,44.2 71.17,50.75 71.63,50.75 C15.1
FILTD
  Top 0.152: 18.14,39.47 16.92,39.47 16,40.39 C2.+ | 18.14,39.47 23.32,39.47 25.15,41.3 32.77,41.3 33.22,41.76 33.22,46.18 36.73,49.68 37.64,49.68 U$1.41 | 18.14,39.47 18.14,46.02 17.22,46.94 17.22,48.77 C1.1
FILTOUT0  (via drill 0.3)
  Top 0.152: R13.2 27.58,84.73 v24.99,84.73 23.16,84.73 22.55,85.34 22.55,86.11 23.47,87.02 61.57,87.02 63.25,85.34 63.25,73.76 57.15,67.67 C28.1 | v14.02,83.36 14.02,82.45 18.29,78.18 R12.2
  Bottom 0.152: v24.99,84.73 18.44,78.18 R12.2 | X4.1 37.8,15.24 31.09,21.95 26.67,21.95 22.86,25.76 3.96,25.76 0.91,28.8 0.91,75.13 9.14,83.36 v14.02,83.36
FILTOUT1  (via drill 0.3)
  Top 0.152: R16.2 26.06,78.18 27.28,78.18 28.19,79.1 30.18,79.1 31.09,78.18 R17.2 | C32.1 58.52,64.77 57.61,63.86 50.44,63.86 49.84,64.47 49.84,65.08 53.03,68.28 56.84,68.28 57.45,68.89 57.45,69.65 57,70.1 48.01,70.1 44.2,73.91 44.2,77.11 44.81,77.72 44.81,79.1 v44.04,79.86 | X5.1 60.66,15.24 64.31,18.9 90.98,18.9 92.81,20.73 92.81,30.79 97.69,35.66 97.69,56.84 94.18,60.35 90.53,60.35 88.39,62.48 88.39,73.46 85.5,76.35 85.5,78.49 84.89,79.1 81.53,79.1 80.01,77.57 v80.01,67.82
  Bottom 0.152: v44.04,79.86 40.69,83.21 27.74,83.21 27.43,83.52 27.13,83.52 26.36,82.75 26.36,78.49 26.06,78.18 R16.2 | v80.01,67.82 66.45,67.82 63.4,64.77 C32.1
FILTOUT2  (via drill 0.3)
  Top 0.152: R20.2 36.27,85.8 38.71,85.8 R21.2 | X6.1 77.11,15.24 79.4,17.53 94.79,17.53 97.99,20.73 97.99,57.45 92.81,62.64 v92.81,63.4
  Bottom 0.152: R21.2 38.86,85.65 39.78,84.73 42.67,84.73 52.43,74.98 52.43,73.61 51.51,72.69 42.82,72.69 40.23,75.29 36.42,75.29 32.31,71.17 30.79,71.17 24.84,65.23 24.84,64.31 25.45,63.7 27.43,63.7 29.11,62.03 40.84,62.03 43.13,59.74 43.74,59.74 C36.1 43.89,59.74 45.41,61.27 76.66,61.27 78.79,63.4 81.38,63.4 82.45,64.47 82.45,65.38 83.21,66.14 90.07,66.14 v92.81,63.4
FILTOUT3
  Top 0.152: R25.2 41.3,85.8 43.74,85.8 R24.2
  Bottom 0.152: C40.1 49.53,64.77 53.03,68.28 56.84,68.28 57.45,68.89 | 57.45,68.89 57.45,69.65 54.56,72.54 54.56,74.98 51.05,78.49 49.84,78.49 47.24,81.08 47.24,86.11 46.63,86.72 44.81,86.72 R24.2 | X7.1 92.51,15.24 97.69,20.42 97.69,62.33 93.27,66.75 85.95,66.75 84.28,68.43 66.6,68.43 65.84,67.67 58.67,67.67 57.45,68.89
GND  (via drill 0.3)
  Top 0.152: JP2.20 81.38,67.36 81.38,69.8 JP2.22 81.38,69.95 83.82,69.95 JP2.21 | SV2.10 92.2,80.62 92.2,79.4 95.56,76.05 95.56,68.73 S1.1 95.71,68.58 95.71,62.18 S1.2 | R25.1 41.15,78.18 38.86,78.18 R21.1 | v27.28,82.91 30.02,85.65 31.09,85.65 R17.1 | 57.76,74.37 62.18,74.37 C35.2 62.33,74.37 62.33,80.01 C31.2 | 57.76,74.37 56.54,74.37 C39.2 | 41.6,55.02 41.3,54.71 41.3,53.8 U$1.33 | 41.6,55.02 42.52,55.02 42.82,54.71 42.82,53.8 U$1.30 42.82,53.65 42.82,52.58 | 42.82,52.58 43.13,52.27 44.96,52.27 45.26,52.58 45.26,53.65 U$1.25 | 39.17,50.9 39.17,49.38 39.01,49.23 37.8,49.23 U$1.42 37.64,49.07 36.58,49.07 35.66,48.16 35.66,46.63 38.1,44.2 39.78,44.2 U$1.1 | 39.17,50.9 39.01,51.05 37.8,51.05 U$1.38 37.8,51.21 37.8,51.66 U$1.37 | 42.82,52.58 41.15,50.9 39.17,50.9 | 53.8,64.77 C8.2 53.95,64.77 | 53.8,64.77 C5.2 | v31.09,67.36 29.87,68.58 29.87,69.04 IC3.11 | C6.2 41.6,64.77 | 41.6,64.77 C36.2 | 41.6,64.77 41.6,58.22 | 41.6,58.22 41.6,55.02 | 57.76,74.37 57.76,68.73 53.8,64.77 | 57.15,59.74 56.24,60.66 50.44,60.66 49.53,59.74 47.09,59.74 C40.2 | 57.15,59.74 60.2,59.74 C32.2 60.35,59.74 64.77,59.74 C27.2 | 57.15,59.74 C28.2 | U$1.7 42.82,44.2 42.82,45.57 43.59,46.33 44.2,46.33 45.26,45.26 45.26,44.2 U$1.12 45.26,44.04 45.57,44.04 v46.02,43.59 | 57.15,52.58 52.73,52.58 C11.- | 57.15,52.58 61.57,52.58 C4.- | 57.15,52.58 C3.- | IC1.1 50.9,21.03 50.9,23.47 IC1.2 50.9,23.62 50.9,25.91 IC1.3 50.9,26.06 50.9,28.5 IC1.4 50.9,28.65 55.32,28.65 58.37,31.7 | C10.2 71.78,44.5 71.78,47.55 C9.2 | JP5.4 58.37,31.7 | LED1.K 7.62,55.93 8.53,56.84 8.53,59.89 IC2.1 8.69,60.05 14.33,60.05 C49.- 17.07,59.13 17.07,55.93 C24.2
  Top 0.152: C2.- 16,42.22 16,44.65 17.07,45.72 C12.2 | C51.1 22.25,51.97 22.25,48.92 C1.2 22.25,48.77 24.54,46.48 27.28,46.48 C17.1 | C14.2 2.59,36.88 2.59,35.05 R29.1 | R2.1 33.68,22.86 32.46,24.08 22.25,24.08 JP4.3 | R27.1 10.21,32.31 10.21,29.26 11.12,28.35 11.12,27.74 15.24,23.62 C42.2 | 74.37,9.75 74.37,5.64 X6.2@2 | 74.37,9.75 79.86,15.24 X6.2@1 X7.2 85.34,15.24 90.68,9.91 | 90.68,9.91 90.68,5.64 X7.2@2 | X7.2@1 96.01,15.24 90.68,9.91 | 8.84,9.6 8.84,9.75 3.35,15.24 X1.2 | 8.84,9.6 8.84,5.64 X1.2@2 | 8.84,9.6 X1.2@1 X2.2 19.2,15.24 24.84,9.6 | 57.91,9.91 57.91,5.64 X5.2@2 | 57.91,9.91 63.25,15.24 X5.2@1 X6.2 68.89,15.24 74.37,9.75 | 24.84,9.6 24.84,9.75 30.33,15.24 X2.2@1 X4.2 40.69,9.6 | 24.84,9.6 24.84,5.64 X2.2@2 | 40.69,9.6 40.69,9.75 46.18,15.24 X4.2@1 X5.2 52.27,15.24 57.61,9.91 57.91,9.91 | 40.69,9.6 40.69,5.64 X4.2@2 | 58.37,31.7 68.58,21.49 JP3.6 | v41.45,58.22 41.6,58.22
  Bottom 0.152: JP2.21 83.82,69.95 90.07,69.95 90.68,70.56 93.73,70.56 95.56,68.73 S1.1 | R21.1 38.71,78.18 37.8,79.1 30.79,79.1 29.87,78.18 28.65,78.18 R13.1 27.28,79.4 v27.28,82.91 | C35.2 62.33,74.37 63.4,75.44 67.21,75.44 JP10.1 67.36,75.44 72.85,69.95 81.23,69.95 JP2.22 | v31.09,67.36 37.95,67.36 40.54,64.77 C6.2 | C5.2 49.99,64.77 49.07,63.86 44.81,63.86 43.89,64.77 C36.2 | C31.2 60.2,80.01 52.58,87.63 34.29,87.63 32.46,85.8 31.24,85.8 R17.1 | 64.77,53.95 63.09,53.95 C4.- | 64.77,53.95 66.6,53.95 C45.2 | v46.02,43.59 48.16,45.72 48.16,49.53 51.05,52.43 52.58,52.43 C11.- | 64.77,53.95 C27.2 | 62.03,46.33 66.6,50.9 C15.2 66.75,50.75 68.58,50.75 71.63,47.7 C9.2 | 62.03,46.33 61.72,46.02 C16.- 62.03,46.33 | JP5.4 63.55,36.88 63.86,36.88 71.32,44.35 71.63,44.35 C10.2 | 62.03,46.33 61.87,46.33 59.89,48.31 51.36,48.31 50.75,48.92 50.75,49.23 51.21,49.68 51.66,49.68 54.41,52.43 57.15,52.43 C3.- | LED1.K 7.62,55.78 5.18,53.34 JP13.1 2.13,53.34 2.13,50.44 1.52,49.84 1.52,40.39 C14.2 | C49.- C50.- | C13.- 22.86,42.22 16,42.22 C2.- | C12.2 19.05,45.72 C1.2 | C24.2 17.22,55.78 18.44,55.78 22.1,52.12 C51.1 22.25,52.12 24.69,54.56 27.28,54.56 C18.1 27.43,54.71 30.63,54.71 35.51,59.59 37.34,59.59 C7.2 37.49,59.59 38.86,58.22 v41.45,58.22 | R27.1 10.06,32.46 5.03,32.46 2.59,34.9 R29.1 | C42.2 15.24,23.62 17.22,23.62 17.98,24.38 21.95,24.38 22.1,24.23 JP4.3 22.25,24.08 30.33,16 30.33,15.24 X2.2@1 | C44.2 5.64,20.88 5.64,17.53 3.35,15.24 X1.2 | JP3.6 68.58,15.24 X6.2
IN_BCLK  (via drill 0.3)
  Top 0.152: v43.74,45.72 43.74,44.2 U$1.9 | v42.06,41.6 44.04,41.6 45.41,40.23 84.43,40.23 89.15,44.96 89.15,49.38 88.24,50.29 84.58,50.29 JP2.5
  Bottom 0.152: v43.74,45.72 43.74,44.65 41.76,42.67 41.76,41.91 v42.06,41.6
IN_LRCLK  (via drill 0.3)
  Top 0.152: v44.81,41.6 43.28,43.13 43.28,44.04 U$1.8
  Bottom 0.152: v44.81,41.6 65.68,41.6 65.84,41.76 66.75,41.76 66.9,41.6 67.51,41.6 72.85,46.94 81.23,46.94 JP2.4
MCLK_IN
  Bottom 0.152: JP1.3 29.72,64.77 32.16,62.33 77.27,62.33 81.08,66.14 82.75,66.14 83.82,67.21 JP2.19
MP1  (via drill 0.3)
  Top 0.152: v50.29,42.22 45.11,42.22 44.35,42.98 44.35,44.04 U$1.10 | v67.36,42.22 73.91,42.22 81.23,49.53 JP2.6
  Bottom 0.152: v67.36,42.22 v50.29,42.22
MP2
  Top 0.152: U$1.29 43.28,53.8 43.28,57.76 47.85,62.33 78.79,62.33 81.23,64.77 JP2.18
MP3
  Top 0.152: JP2.16 81.08,62.03 48.01,62.03 43.89,57.91 43.89,53.8 U$1.28
MP6
  Top 0.152: U$1.15 47.4,47.09 50.14,47.09 53.65,50.6 65.08,50.6 66.6,52.12 79.86,52.12 81.23,53.49 82.75,53.49 83.82,54.56 JP2.9
MP7
  Top 0.152: U$1.14 47.4,46.63 60.96,46.63 64.16,49.84 69.49,49.84 71.48,51.82 81.08,51.82 81.23,51.97 JP2.8
MP8  (via drill 0.3)
  Top 0.152: v81.84,60.96 69.8,60.96 67.51,58.67 48.31,58.67 44.35,54.71 44.35,53.8 U$1.27
  Bottom 0.152: v81.84,60.96 84.12,60.96 84.89,61.72 84.89,63.7 JP2.17
MP9  (via drill 0.3)
  Top 0.152: v49.99,57.45 47.55,57.45 44.81,54.71 44.81,53.8 U$1.26
  Bottom 0.152: v49.99,57.45 53.49,60.96 80.01,60.96 JP2.14
MP10  (via drill 0.3)
  Top 0.152: v49.99,47.7 47.4,47.7 U$1.16 | v61.27,47.7 v59.74,47.7
  Bottom 0.152: v59.74,47.7 v49.99,47.7 | v61.27,47.7 62.18,47.7 69.65,55.17 80.77,55.17 81.23,54.71 JP2.10
MP11  (via drill 0.3)
  Top 0.152: v51.36,49.07 47.4,49.07 U$1.19
  Bottom 0.152: v51.36,49.07 63.09,49.07 72.24,58.22 82.75,58.22 JP2.11
N$1  (via drill 0.3)
  Top 0.152: v39.78,41.15 40.84,42.22 40.84,44.04 U$1.3 | v39.01,37.49 39.01,34.59 39.17,34.44 39.17,34.14 38.41,33.38 37.19,33.38 35.05,31.24 35.05,30.48 R2.2
  Bottom 0.152: v39.78,41.15 39.01,40.39 v39.01,37.49
N$2  (via drill 0.3)
  Top 0.152: v45.72,47.7 46.18,48.16 47.24,48.16 U$1.17 | v46.02,44.5 46.33,44.5 47.4,43.43 51.21,43.43 52.27,42.37 52.27,42.06 T1.1 | v26.06,27.58 26.06,27.89 28.96,30.79 28.96,32.77 v34.59,38.41
  Bottom 0.152: 45.72,46.33 45.72,44.81 v46.02,44.5 | 45.72,46.33 v45.72,47.7 | v26.06,27.58 29.72,23.93 29.72,22.86 R1.1 | v34.59,38.41 42.52,46.33 45.72,46.33
N$3
  Top 0.152: U$1.35 40.23,53.8 40.23,58.83 C20.2 C19.2
N$4  (via drill 0.3)
  Top 0.152: C23.1 22.25,74.37 24.23,74.37 26.67,76.81 34.29,76.81 36.73,74.37 C30.1 | IC3.13 32.46,69.19 33.53,69.19 IC3.14 33.68,69.19 34.59,70.1 36.88,70.1 | v40.69,61.42 40.69,63.4 37.8,66.29 37.8,69.65 37.34,70.1 36.88,70.1 | 36.88,70.1 v36.88,70.41
  Bottom 0.152: v40.69,61.42 45.26,56.84 50.14,56.84 50.6,57.3 50.6,57.61 53.65,60.66 65.08,60.66 65.99,59.74 70.41,59.74 C33.2 | v36.88,70.41 36.88,74.22 C30.1
N$5  (via drill 0.3)
  Top 0.152: v23.32,57.15 12.95,67.51 12.95,71.93 12.04,72.85 12.04,77.27 12.34,77.57 12.34,86.11 12.95,86.72 13.72,86.72 14.63,85.8 15.85,85.8 R7.2
  Bottom 0.152: v23.32,57.15 31.85,57.15 34.29,59.59 C20.1
N$6
  Top 0.152: 24.84,60.81 24.84,56.84 26.36,55.32 26.36,53.03 27.28,52.12 C18.2 | 24.84,60.81 24.84,61.87 21.03,65.68 21.03,69.19 18.14,72.08 18.14,77.11 13.41,81.84 13.41,85.65 R6.2 | 24.84,60.81 27.89,60.81 31.7,57 31.7,54.41 Q1.2
N$7
  Top 0.152: 28.19,43.89 30.94,43.89 Q1.1 | 28.19,43.89 27.43,43.89 C17.2 | JP1.1 26.67,56.54 28.19,55.02 28.19,43.89
N$8  (via drill 0.3)
  Top 0.152: v39.32,51.66 41.45,51.66 42.22,52.43 42.22,53.65 U$1.31 | v25.76,53.95 25.76,55.47 21.49,59.74 21.18,59.74 18.14,62.79 18.14,68.89 16,71.02 15.39,71.02 12.65,73.76 12.65,77.42 R6.1
  Bottom 0.152: v39.32,51.66 29.11,51.66 27.13,53.65 26.06,53.65 v25.76,53.95
N$9
  Top 0.152: R8.1 3.81,49.53 LED1.A
N$10
  Top 0.152: U$1.32 41.76,53.65 41.76,52.58 41.15,51.97 39.93,51.97 32,59.89 32,60.2 30.02,62.18 26.67,62.18 JP1.2
N$11
  Bottom 0.152: Q4.1 17.22,35.51 18.44,34.29 21.64,34.29 25.45,30.48 R37.1 27.43,30.48 29.41,28.5 31.09,28.5 39.62,19.96 51.51,19.96 55.02,23.47 81.69,23.47 82.45,22.71 82.45,20.73 83.52,19.66 89.31,19.66 91.14,21.49 91.44,21.49 JP3.15
N$12
  Bottom 0.152: C47.2 16.46,69.34 16.46,73 15.24,74.22 15.24,76.2 18.29,79.25 18.29,85.65 R12.1 18.44,85.8 19.36,86.72 26.36,86.72 26.98,86.11 26.98,85.95 29.41,83.52 41.3,83.52 44.96,79.86 47.09,79.86 52.12,74.83 52.12,73.76 51.36,73 45.11,73 43.89,74.22 42.67,74.22 C21.2
N$13  (via drill 0.3)
  Top 0.152: v17.53,76.05 v14.63,76.05 | C29.1 50.75,85.04 49.53,85.04 48.01,83.52 30.18,83.52 29.72,83.97 29.72,84.28 30.18,84.73 31.39,84.73 32,85.34 32,86.11 31.39,86.72 24.54,86.72 23.62,85.8 R15.1
  Bottom 0.152: v14.63,76.05 13.56,77.11 10.52,77.11 9.6,78.03 8.38,78.03 R14.2 | v17.53,76.05 18.59,77.11 18.75,77.11 19.96,78.33 19.96,78.94 25.6,84.58 25.6,84.89 24.84,85.65 23.62,85.65 R15.1
N$14  (via drill 0.3)
  Top 0.152: R38.1 16.61,28.04 16.61,28.65 23.47,35.51 Q5.1 | v87.78,29.57 88.85,28.5 88.85,21.64 JP3.14
  Bottom 0.152: v87.78,29.57 32,29.57 30.79,30.79 30.79,30.94 30.33,31.39 29.57,31.39 25.45,35.51 23.62,35.51 Q5.1
N$15
  Top 0.152: C29.2 45.11,80.01 44.35,80.77 43.13,80.77 42.22,79.86 42.22,75.74 39.78,73.3 34.59,73.3 33.68,74.22 IC3.1 33.53,74.37 32.46,74.37 IC3.2 32.31,74.22 32.31,73.15 31.09,71.93 26.98,71.93 24.38,69.34 22.25,69.34 C26.1
  Bottom 0.152: C26.1 22.1,69.19 21.03,69.19 20.12,68.28 19.36,68.28 16.76,70.87 16.76,74.07 16.61,74.22 C22.1
N$16  (via drill 0.3)
  Top 0.152: v29.26,75.89 30.18,75.89 31.09,74.98 31.09,74.37 IC3.3 | v47.4,75.29 53.03,80.92 57,80.92 57.3,80.62 58.52,80.62 62.18,84.28 62.18,85.04 C31.1 | v41,75.29 40.23,75.29 37.19,78.33 37.19,78.49 36.27,79.4 24.84,79.4 23.62,78.18 R15.2
  Bottom 0.152: v29.26,75.89 25.76,75.89 23.62,78.03 R15.2 | v41,75.29 v47.4,75.29
N$17
  Top 0.152: R9.2 10.82,78.18 10.82,84.43 12.04,85.65 12.04,86.26 12.8,87.02 19.66,87.02 R10.1 24.38,82.3 49.38,82.3 52.12,85.04 56.39,85.04 C25.1
N$18  (via drill 0.3)
  Top 0.152: C25.2 55.17,80.01 49.53,74.37 45.11,74.37 C21.1 | IC3.6 27.28,74.37 26.06,74.37 IC3.7 25.91,74.22 v25.15,73.46 | v17.53,68.28 16.15,68.28 15.24,69.19 14.02,69.19 C47.1
  Bottom 0.152: v17.53,68.28 18.9,68.28 19.2,67.97 22.25,67.97 25.15,70.87 v25.15,73.46 27.58,73.46 30.33,76.2 38.56,76.2 39.93,77.57 39.93,78.03 41,79.1 47.4,79.1 51.82,74.68 51.82,73.91 51.21,73.3 50.44,73.3 49.53,74.22 45.11,74.22 C21.1
N$19
  Top 0.152: C22.2 14.02,74.22 14.78,74.22 19.66,69.34 C26.2
  Bottom 0.152: R16.1 25.91,85.65 25.91,81.84 21.95,77.88 21.95,75.29 19.81,73.15 19.81,69.34 C26.2
N$20  (via drill 0.3)
  Top 0.152: 21.34,72.54 19.66,72.54 18.44,73.76 18.44,75.59 R10.2 | 21.34,72.54 31.24,72.54 31.7,73 31.7,75.59 30.79,76.5 29.11,76.5 28.65,76.05 28.65,74.37 IC3.5 | C27.1 61.72,64.77 60.5,63.55 v42.22,63.55 | v36.88,66.75 23.32,66.75 21.34,68.73 21.34,72.54
  Bottom 0.152: v42.22,63.55 40.08,63.55 v36.88,66.75
N$21  (via drill 0.3)
  Top 0.152: v17.07,80.31 24.54,80.31 v24.84,80.01 | C33.1 69.19,64.77 v65.68,68.28 | v49.99,79.1 45.57,79.1 44.2,80.47 43.59,80.47 v42.82,79.7
  Bottom 0.152: v17.07,80.31 15.85,79.1 7.92,79.1 7.01,78.18 5.79,78.18 R18.2 | v24.84,80.01 24.84,78.03 25.76,77.11 32.61,77.11 33.53,78.03 R19.1 33.68,78.03 34.59,77.11 39.01,77.11 39.62,77.72 39.62,78.18 41.15,79.7 v42.82,79.7 | v65.68,68.28 59.28,68.28 54.86,72.69 54.86,75.13 50.9,79.1 v49.99,79.1
N$22
  Top 0.152: 35.81,77.72 R20.1 36.12,78.03 | 35.81,77.72 35.2,77.11 23.77,77.11 21.03,74.37 19.81,74.37 C23.2 | 35.81,77.72 35.97,77.72 39.32,74.37 C30.2
N$23  (via drill 0.3)
  Top 0.152: v49.07,25.45 49.07,25.91 42.67,32.31 R35.1
  Bottom 0.152: Q2.1 9.6,28.65 10.82,28.65 11.73,29.57 16.92,29.57 17.53,30.18 17.53,33.83 16.15,35.2 16.15,35.97 16.76,36.58 18.59,36.58 20.57,34.59 21.34,34.59 22.55,35.81 22.55,35.97 23.16,36.58 26.52,36.58 29.72,33.38 32.77,33.38 33.98,32.16 33.98,32 34.59,31.39 41.6,31.39 42.52,32.31 R35.1 | v49.07,25.45 49.38,25.15 90.37,25.15 93.88,21.64 JP3.16
N$24  (via drill 0.3)
  Top 0.152: v37.19,67.97 36.58,67.36 31.85,67.36 31.24,67.97 31.24,69.04 IC3.12 | v54.25,70.71 56.69,70.71 v57.15,71.17
  Bottom 0.152: v37.19,67.97 51.51,67.97 v54.25,70.71 | C35.1 62.18,69.34 60.35,71.17 v57.15,71.17 55.63,72.69 55.63,81.53 49.84,87.33 35.97,87.33 34.44,85.8 33.68,85.8 R19.2
N$25  (via drill 0.3)
  Top 0.152: v6.86,21.18 5.49,22.55 5.33,22.55 3.2,24.69 3.2,28.5 Q3.1
  Bottom 0.152: R36.1 6.25,30.48 4.42,28.65 3.2,28.65 Q3.1 | v6.86,21.18 10.67,17.37 19.81,17.37 23.93,13.26 85.95,13.26 89.31,16.61 91.29,16.61 96.16,21.49 96.47,21.49 JP3.17
N$26
  Bottom 0.152: R22.2 10.82,76.2 10.82,73.76 15.54,69.04 15.54,68.58 17.37,66.75 25.91,66.75 35.05,75.89 44.2,75.89 46.33,78.03 R23.1 46.48,78.03 50.14,74.37 50.75,74.37 C37.1
N$27
  Top 0.152: IC3.8 26.06,69.19 27.28,69.19 IC3.9 27.43,69.04 27.43,68.43 28.19,67.67 28.96,67.67 29.26,67.97 29.26,70.41 29.41,70.56 31.55,70.56 31.7,70.41 31.7,67.97 32,67.67 35.2,67.67 36.73,69.19 C34.1
  Bottom 0.152: C34.1 36.88,69.34 38.1,69.34 38.86,70.1 41.76,70.1 42.52,69.34 C38.1 43.43,70.1 45.57,70.1 46.33,69.34 50.75,69.34 C37.2
N$28
  Top 0.152: IC3.10 28.65,69.19 28.65,70.26 29.41,71.02 37.03,71.02 38.41,69.65 38.41,68.89 39.01,68.28 52.58,68.28 53.49,69.19 56.39,69.19 C39.1
  Bottom 0.152: C39.1 54.25,71.48 54.25,73.61 46.48,81.38 46.48,85.65 R23.2
N$29
  Top 0.152: 43.89,70.1 44.2,70.1 C38.2 | 43.89,70.1 42.06,70.1 41.3,69.34 39.47,69.34 C34.2 | 43.89,70.1 43.89,78.03 R24.1
N$30
  Top 0.152: JP8.5 94.64,49.53 94.64,47.09 JP8.3 94.64,46.94 94.64,44.5 JP8.1 94.49,44.35 94.18,44.35 87.48,37.64 87.48,35.66 75.29,23.47 70.71,23.47 69.65,22.4 69.65,20.42 68.89,19.66 48.92,19.66 43.43,25.15 23.47,25.15 23.32,25.3 20.12,25.3 18.44,23.62 C46.2
  Bottom 0.152: C48.2 2.59,23.47 4.42,23.47 5.33,22.55 17.37,22.55 18.29,23.47 C46.2
N$31
  Top 0.152: C46.1 18.29,21.03 15.24,21.03 C42.1 15.24,20.88 14.63,20.88 8.99,15.24 X1.1 8.84,15.24 3.2,20.88 2.59,20.88 C48.1 2.44,21.03 1.52,21.95 1.52,28.19 2.44,29.11 2.44,32.31 R27.2
N$32
  Bottom 0.152: R26.1 35.05,32.46 36.27,32.46 37.49,33.68 82.91,33.68 85.19,35.97 85.19,37.95 91.59,44.35 92.05,44.35 JP8.2
N$33
  Top 0.152: R30.1 37.49,32.46 38.71,32.46 43.43,37.19 53.49,37.19 55.93,39.62 84.73,39.62 92.05,46.94 JP8.4
N$34
  Top 0.152: 6.4,23.47 5.79,23.47 C44.1 | 6.4,23.47 8.84,21.03 C43.1 8.99,21.03 12.04,21.03 C41.1 | 6.4,23.47 6.71,23.77 6.71,30.33 10.06,33.68 10.06,34.9 R29.2
  Bottom 0.152: X2.1 22.4,15.24 19.96,17.68 15.39,17.68 12.19,20.88 C41.1
N$35
  Top 0.152: R31.1 27.43,32.46 27.89,32.46 34.44,39.01 40.39,39.01 41.6,40.23 41.6,40.39 42.22,41 44.2,41 45.26,39.93 84.58,39.93 90.98,46.33 90.98,48.46 92.05,49.53 JP8.6
N$36
  Top 0.152: 94.64,53.34 94.64,55.78 JP9.3 94.64,55.93 94.64,58.37 JP9.5 | 94.64,53.34 95.71,52.27 95.71,44.04 95.4,43.74 95.4,35.97 90.37,30.94 90.37,20.73 88.85,19.2 42.98,19.2 42.06,20.12 21.34,20.12 19.2,22.25 14.17,22.25 12.95,23.47 12.19,23.47 C41.2 | 94.64,53.34 JP9.1
  Bottom 0.152: C43.2 8.99,23.47 12.04,23.47 C41.2
N$37
  Top 0.152: R28.1 40.08,32.46 41.3,32.46 44.5,35.66 52.43,35.66 55.93,39.17 84.73,39.17 91.44,45.87 92.51,45.87 93.12,46.48 93.12,52.43 92.2,53.34 JP9.2
N$38  (via drill 0.3)
  Top 0.152: v31.39,33.98 29.87,32.46 R32.1
  Bottom 0.152: v31.39,33.98 73.15,33.98 75.13,35.97 75.13,38.1 80.31,43.28 81.69,43.28 82.75,44.35 82.75,44.96 83.36,45.57 84.43,45.57 90.98,52.12 90.98,54.71 92.05,55.78 JP9.4
N$39  (via drill 0.3)
  Top 0.152: v34.59,34.59 R33.1
  Bottom 0.152: v34.59,34.59 71.17,34.59 72.54,35.97 72.54,37.95 80.47,45.87 84.28,45.87 90.68,52.27 90.68,57 92.05,58.37 JP9.6
N$40
  Top 0.152: R26.2 35.05,40.08 37.34,40.08 R30.2 | U$1.2 40.23,44.04 40.23,42.98 40.08,42.82 37.64,42.82 37.34,43.13 35.05,43.13 32.92,41 28.35,41 27.43,40.08 R31.2
  Bottom 0.152: R26.2 34.9,40.08 33.68,40.08 32.77,41 28.35,41 27.43,40.08 R31.2
N$43
  Top 0.152: IC1.7 43.13,23.47 36.88,23.47 35.05,21.64 22.25,21.64 JP4.2
SCL
  Top 0.152: IC1.6 43.13,26.06 17.07,26.06 14.63,28.5 14.63,35.51 Q4.3 | U$1.23 47.4,51.21 49.84,51.21 51.97,53.34 64.77,53.34 67.51,56.08 81.69,56.08 82.75,57.15 82.75,61.11 83.82,62.18 JP2.15 83.82,62.33 84.89,63.4 84.89,70.26 81.99,73.15 81.99,78.03 SV2.1
  Bottom 0.152: R4.1 2.59,46.94 8.84,46.94 10.36,45.41 10.52,45.41 14.48,41.45 14.48,35.66 Q4.3 | IC1.6 43.28,26.06 48.92,26.06 50.44,27.58 86.56,27.58 92.81,33.83 92.81,43.59 93.12,43.89 93.12,62.33 92.2,63.25 92.2,63.4 89.76,65.84 83.36,65.84 82.75,65.23 82.75,63.4 83.82,62.33 JP2.15
SDA  (via drill 0.3)
  Top 0.152: v87.33,59.89 87.33,70.71 84.58,73.46 84.58,78.03 SV2.3 | v50.44,50.29 50.14,50.6 47.4,50.6 U$1.22 | R5.1 10.97,41.91 14.48,38.41 v20.27,38.41 | v35.2,36.88 35.2,34.44 33.98,33.22 33.98,30.02 34.44,29.57 35.36,29.57 36.27,28.65 43.13,28.65 IC1.5 | v58.67,57.15 JP2.12
  Bottom 0.152: v87.33,59.89 87.33,59.13 84.28,56.08 82.45,56.08 81.38,57.15 JP2.12 | 21.03,37.64 21.79,38.41 25.6,38.41 27.13,36.88 v35.2,36.88 39.17,36.88 41,38.71 41,39.78 43.43,42.22 45.87,42.22 48.77,45.11 48.77,47.24 50.44,48.92 v50.44,50.29 51.82,50.29 v58.67,57.15 | 21.03,37.64 21.03,35.66 Q5.3 | 21.03,37.64 v20.27,38.41
SDATA_IN  (via drill 0.3)
  Top 0.152: v51.05,42.82 45.11,42.82 44.81,43.13 44.81,44.04 U$1.11
  Bottom 0.152: v51.05,42.82 68.28,42.82 72.69,47.24 72.69,51.66 70.87,53.49 70.87,54.41 71.32,54.86 79.55,54.86 81.23,53.19 82.75,53.19 83.82,52.12 JP2.7
V+  (via drill 0.3)
  Top 0.152: 6.71,54.86 3.81,54.86 2.29,56.39 JP12.1 | 6.71,54.86 7.47,54.86 10.21,52.12 17.07,52.12 C51.2 | IC2.3 8.53,64.62 8.53,68.43 8.38,68.58 D1.C D3.C | C49.+ 15.24,63.55 9.6,63.55 8.69,64.47 IC2.3 | v42.22,59.13 42.22,59.44 45.41,62.64 64.01,62.64 65.68,64.31 65.68,65.23 65.08,65.84 65.08,78.33 67.21,80.47 67.21,81.84 JP6.1 | 6.71,54.86 6.71,62.64 8.53,64.47 IC2.3
  Bottom 0.152: v42.22,59.13 42.22,59.44 40.84,60.81 38.1,60.81 37.8,61.11 25.45,61.11 22.71,63.86 22.71,64.01 22.1,64.62 16.31,64.62 15.24,63.55 C49.+
VOUT0  (via drill 0.3)
  Top 0.152: v39.32,47.24 37.8,47.24 U$1.46 | v10.67,67.36 9.45,68.58 9.45,70.87 4.57,75.74 4.57,85.5 4.72,85.65 4.72,86.11 5.33,86.72 9.75,86.72 10.67,85.8 R9.1
  Bottom 0.152: v39.32,47.24 37.19,47.24 35.81,45.87 28.19,45.87 27.13,44.81 16.76,44.81 10.67,50.9 v10.67,67.36
VOUT1  (via drill 0.3)
  Top 0.152: v36.27,47.09 36.27,47.24 36.58,47.55 37.64,47.55 U$1.45 | v12.5,67.06 12.5,71.93 9.45,74.98 9.45,84.58 8.38,85.65 R14.1
  Bottom 0.152: v36.27,47.09 36.88,47.7 36.88,48.16 34.29,50.75 20.42,50.75 12.5,58.67 v12.5,67.06
VOUT2  (via drill 0.3)
  Top 0.152: v36.27,48.01 36.42,48.16 37.64,48.16 U$1.44 | v11.73,67.82 11.73,71.02 6.86,75.89 6.86,84.58 R18.1
  Bottom 0.152: v36.27,48.01 24.38,48.01 21.95,50.44 20.27,50.44 11.73,58.98 v11.73,67.82
VOUT3  (via drill 0.3)
  Top 0.152: v39.32,48.62 37.8,48.62 U$1.43
  Bottom 0.152: v39.32,48.62 36.88,48.62 34.44,51.05 20.57,51.05 13.11,58.52 13.11,67.21 11.73,68.58 R22.1
WB
  Top 0.152: U$1.20 47.4,49.68 52.27,49.68 53.49,50.9 64.92,50.9 66.45,52.43 77.57,52.43 80.92,55.78 83.97,55.78 84.89,56.69 84.89,58.52 83.82,59.59 JP2.13
WP  (via drill 0.3)
  Top 0.152: v45.11,50.14 47.24,50.14 U$1.21 | v35.97,41 34.59,41 33.38,39.78 33.38,39.62 27.13,33.38 26.98,33.38 25.15,31.55 v25.15,29.87 | R3.1 2.44,44.35 2.44,43.13 1.52,42.22 1.52,41.6 4.12,39.01 6.71,39.01 9.91,35.81 10.67,35.81 12.04,34.44 12.04,28.65 Q2.3 12.19,28.5 16.15,24.54 16.15,23.01 15.7,22.55 14.78,22.55 12.95,24.38 11.58,24.38 11.12,23.93 11.12,23.16 12.34,21.95 18.75,21.95 21.64,19.05 JP4.1
  Bottom 0.152: v35.97,41 v45.11,50.14 | v25.15,29.87 24.84,29.87 24.23,29.26 12.8,29.26 12.19,28.65 Q2.3

### Text on the board
tPlace: 2x470p | 150p | USBi | 3V3 | 4K7 | 4K7 | 4K7 | 100 | 470 | 600 | 4K7 | 4K7 | 600 | 50K | 50K | 4K7 | 600 | 50K | 50K | 600 | 4K7 | VIN | 5V | 470p | 2x150p | GND | CHECK POINTS | A1=MCLK.IN | 4K7 | 4x4.7 | AD8608 | 4x4.7 | RESET | A2=SDATA.IN | A3=IN.BCLK | GND | GND | 2x1N5818 | B1=IN.LRCLK | GND | A1 | MLCK.IN | 2x100n | 47 | 100 | MP2 | MP8 | MP3 | SCL | 1117 | 3n3 | MP9 | WB | 56n | 0.9 | 2x100n | 2x3n3 | 2x3n3 | 150p | 470p | SDA | MP11 | 12.288 | VIN | 1.2 | MP10 | MP6 | 2.0 | GND | MP7 | A2 | ADC1 | 3x10 | 100 | 2x22p | MP1 | A3 | 0.9 | 4x100n | 4x100n | 10K | B1 | B.RST | 1.2 | 10K | FZT751 | 3V3 | 3V3 | 2.0 | 10 | 10K | GPIO | ADC0 | 2x10 | 5V | 100n | 7K | 7K | 10K | 18K | 10K | 18K | 10K | GND | 50K | ADAU1701 | 50K | 4x2N7000 | 10K | 10K | ANA:LOG71 | 1K | 10K | 10K | 18K | GND | D12 | EEPROM | WP | 4.7 | 100p | 4.7 | 4.7 | 100p | 4.7 | DSP DEVELOPMENT BOARD | ADC0 | ADC1 | OUT0 | OUT1 | OUT2 | OUT3